# Altium schematic sheet 0.powerv4.SchDoc
size A4; DocumentNumber: 1; SheetNumber: 1; SheetTotal: 4
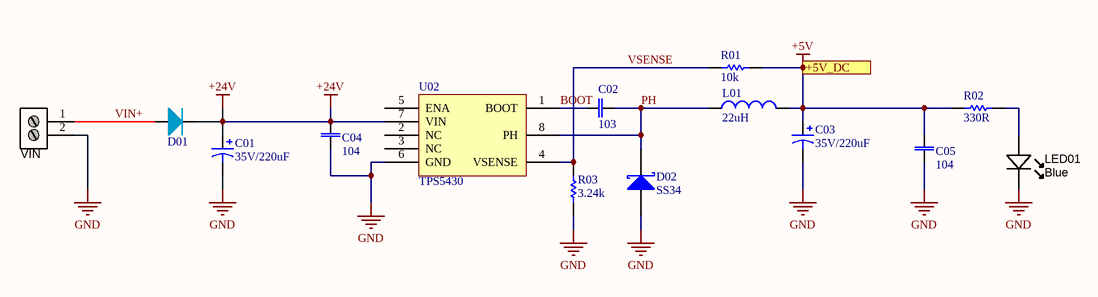
[diagram p0: 0.powerv4.SchDoc]

## Parts
C01  value 35V/220uF  [CAPE3.5-5.0MM_Rad_10x14mm]  (hidden comment: Tụ nhôm cắm35V/220uF)
C02  value 103  [CAP 0805]  (hidden comment: Tụ điện dán 0805103)
C03  value 35V/220uF  [CAPE3.5-5.0MM_Rad_10x14mm]  (hidden comment: Tụ nhôm cắm35V/220uF)
C04  value 104  [CAP 0805]  (hidden comment: Tụ điện dán 0805104)
C05  value 104  [CAP 0805]  (hidden comment: Tụ điện dán 0805104)
D01  Đi ốt dán M7chân DO-214AB  [DO-214AA]  (value not drawn)
D02  SS34  [SMD diode]
L01  value 22uH  [Inductor 12x12x6]  (hidden comment: Cuộn cảm dán22uH)
LED01  Blue  [LED-0805-K]
R01  value 10k  [RES 0805]  (hidden comment: Điện trở dán 080510k)
R02  value 330R  [RES 0805]  (hidden comment: Điện trở dán 0805330R)
R03  value 3.24k  [RES 0805]  (hidden comment: Điện trở dán 08053.24k)
U02  TPS5430  [SOIC 8]
VIN  Giắc xanh 5.08mm  [2P_PCB1]  (value not drawn)

## Ports
+5V_DC

## Nets
+5V: C03.1 C05.2 L01.2 R01.1 R02.2 ; port +5V_DC
+24V: C01.1 C04.2 D01.2(K) U02.7(VIN)
GND: C01.2 C03.2 C04.1 C05.1 D02.1(A) LED01.K R03.1 U02.6(GND) VIN.2
BOOT: C02.1 U02.1(BOOT)
PH: C02.2 D02.2(K) L01.1 U02.8(PH)
VIN+: D01.1(A) VIN.1
VSENSE: R01.2 R03.2 U02.4(VSENSE)
NetLED01_A: LED01.A R02.1

Not connected (* = marked no-connect by the designer): U02 2(NC) 3(NC) 5(ENA)

## Library data of the parts
C01 C03 = Cap: cm: Tụ nhôm cắm
C02 C04 C05 = CAP NP: Capacitor non polarized; cm1: Tụ điện dán 0603; cm3: Tụ điện dán 1206; cm2: Tụ điện dán 0805
D01 = Diode: pin to pad: 1>A 2>K; cm1: Đi ốt cắm; vl2: FR307; vl3: TVS 1.5KE300A 19A 300V; vl4: HER508 5A 1000V; cm2: Đi ốt dán M7; vl5: chân DO-214AB
D02 = Diode Schottky: pin to pad: 1>A 2>K
L01 = Inductor: cm2: Cuộn cảm cắm; cm1: Cuộn cảm dán
LED01 = LED_SMD_Blue_0805_100mcd: LED 0805 SMD Blue 100mcd 470nm; Manufacturer 1: Ligitek; Manufacturer Part Number 1: LG-170DBKZ-CT; Material: InGaN/GaN; Ratings: 100 mcd; 470 nm; Package / Case: 0805; Value: Blue; Color: Blue
R01 R02 R03 = Res: Resistor; cm1: Điện trở dán 0603; cm2: Điện trở cắm 1/4W; cm4: Điện trở dán 1206; cm3: Điện trở dán 0805
VIN = 2P_ScrewTerm_90S_3.81MM: Terminal Block Screw Type THT 2-Position 3.81mm pitch; Manufacturer 1: Tyco Electronics; Manufacturer Part Number 1: 1776113-2; Value: 2 position; Pitch: 0.150" (3.81mm); Positions Per Level: 2; Package / Case: Side Entry; 3.81mm pitch; Category: Connectors Interconnects; Color: Black; Supplier 1: Digi-Key; Supplier Part Number 1: A97976-ND; vl: Giắc xanh 5.08mm